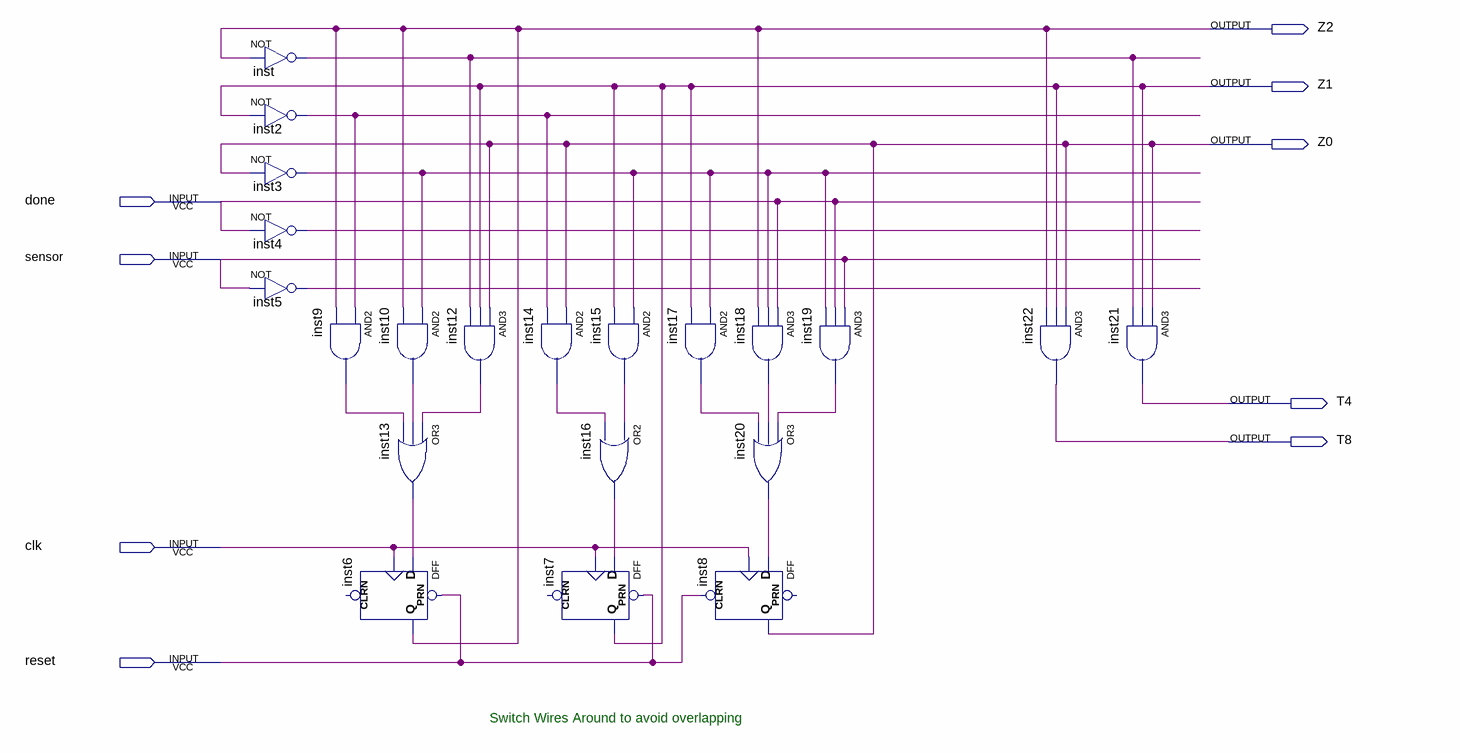
[diagram p0: schematic sheet]
// Quartus schematic TLController.bdf as structural Verilog: 21 symbols, 9 pins
module TLController (
  input  done,
  input  sensor,
  input  clk,
  input  reset,
  output Z2,
  output Z1,
  output Z0,
  output T4,
  output T8
);

  wire inst2_out, inst3_out, inst4_out, inst5_out, inst9_out, inst10_out, inst12_out, inst13_out, inst14_out,
       inst15_out, inst16_out, inst17_out, inst18_out, inst19_out, inst20_out, inst_out;

  not inst (inst_out, Z2);
  not inst2 (inst2_out, Z1);
  not inst3 (inst3_out, Z0);
  not inst4 (inst4_out, done);
  not inst5 (inst5_out, sensor);
  and inst9 (inst9_out, inst2_out, Z2);
  DFF inst6 (.CLK(clk), .D(inst13_out), .PRN(reset), .Q(Z2));  // open: CLRN
  and inst10 (inst10_out, inst3_out, Z2);
  or inst13 (inst13_out, inst12_out, inst10_out, inst9_out);
  and inst12 (inst12_out, Z0, Z1, inst_out);
  and inst14 (inst14_out, Z0, inst2_out);
  and inst15 (inst15_out, inst3_out, Z1);
  or inst16 (inst16_out, inst15_out, inst14_out);
  DFF inst7 (.CLK(clk), .D(inst16_out), .PRN(reset), .Q(Z1));  // open: CLRN
  and inst17 (inst17_out, inst3_out, Z1);
  and inst18 (inst18_out, done, inst3_out, Z2);
  or inst20 (inst20_out, inst19_out, inst18_out, inst17_out);
  DFF inst8 (.CLRN(reset), .CLK(clk), .D(inst20_out), .Q(Z0));  // open: PRN
  and inst19 (inst19_out, sensor, done, inst3_out);
  and inst22 (T8, Z0, Z1, Z2);
  and inst21 (T4, Z0, Z1, inst_out);

  // Notes on the sheet:
  //   Switch Wires Around to avoid overlapping
endmodule
